# Altium schematic sheet Sheet1.SchDoc
size A
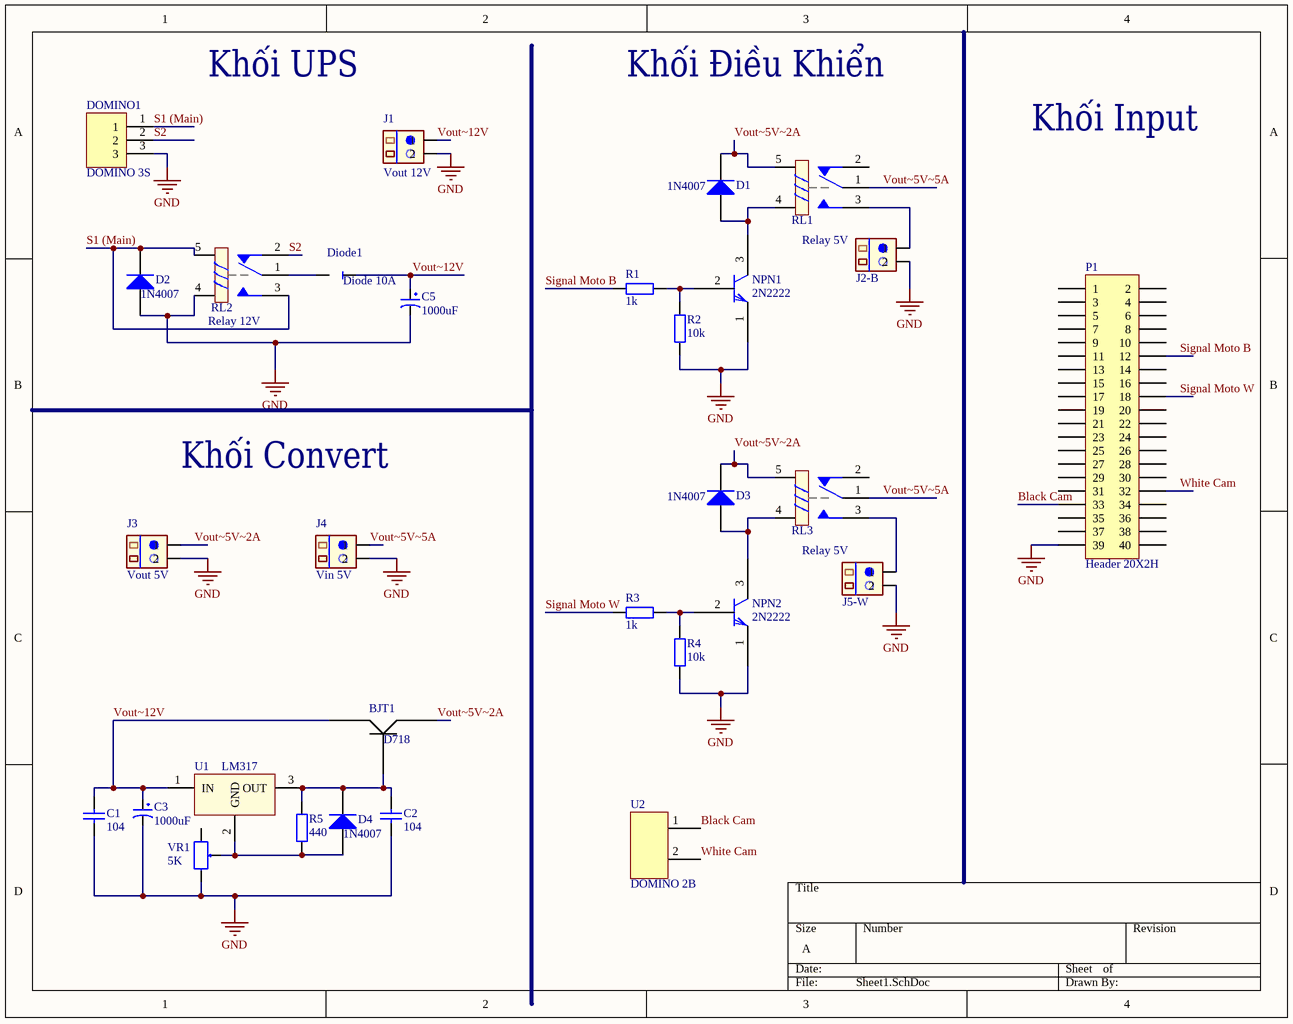
[diagram p0: Sheet1.SchDoc]

## Parts
BJT1  D718  [2sb688]
C1  104  [tu gom]
C2  104  [tu gom]
C3  1000uF  [tu hoa 13mm]
C5  1000uF  [tu hoa 13mm]
D1  1N4007  [DO-41]
D2  1N4007  [DO-41]
D3  1N4007  [DO-41]
D4  1N4007  [DO-41]
Diode1  Diode 10A  [Diode 6A10]
DOMINO1  DOMINO 3S  [DOMINO 3S]
J1  Vout 12V  [Domino 2M]
J2-B  CON.Domino2  [Domino 2M]  (value not drawn)
J3  Vout 5V  [Domino 2M]
J4  Vin 5V  [Domino 2M]
J5-W  CON.Domino2  [Domino 2M]  (value not drawn)
NPN1  2N2222  [PCBComponent_1]
NPN2  2N2222  [PCBComponent_1]
P1  Header 20X2H  [HDR2X20H]
R1  1k  [tro vach 1/4w]
R2  10k  [tro vach 1/4w]
R3  1k  [tro vach 1/4w]
R4  10k  [tro vach 1/4w]
R5  440  [tro vach 1/4w]
RL1  Relay 5V  [PCBComponent_1 - duplicate]
RL2  Relay 12V  [RELAY5PIN-10A]
RL3  Relay 5V  [PCBComponent_1 - duplicate]
U1  LM317  [QTO-220H3]
U2  DOMINO 2B  [DOMINO 2B]
VR1  5K  [RVAR10K]

## Nets
GND: C1.2 C2.2 C3.2 C5.2 D2.1(A) DOMINO1.3 J1.2 J2-B.2 J3.2 J4.2 J5-W.2 NPN1.1 NPN2.1 P1.39 R2.1 R4.1 RL2.4 VR1.3
Black Cam: P1.33 U2.1
S1 (Main): D2.2(K) DOMINO1.1 RL2.3 RL2.5
S2: DOMINO1.2 RL2.2
Signal Moto B: P1.12 R1.1
Signal Moto W: P1.18 R3.1
Vout~5V~2A: BJT1.3 D1.2(K) D3.2(K) J3.1 RL1.5 RL3.5
Vout~5V~5A: J4.1 RL1.1 RL3.1
Vout~12V: BJT1.2 C1.1 C3.1 C5.1 Diode1.2 J1.1 U1.1(IN)
White Cam: P1.32 U2.2
NetBJT1_1: BJT1.1 C2.1 D4.2(K) R5.2 U1.3(OUT)
NetD1_1: D1.1(A) NPN1.3 RL1.4
NetD3_1: D3.1(A) NPN2.3 RL3.4
NetD4_1: D4.1(A) R5.1 U1.2(GND) VR1.2
NetDiode1_1: Diode1.1 RL2.1
NetJ2-B_1: J2-B.1 RL1.3
NetJ5-W_1: J5-W.1 RL3.3
NetNPN1_2: NPN1.2 R1.2 R2.2
NetNPN2_2: NPN2.2 R3.2 R4.2

Not connected (* = marked no-connect by the designer): P1 1 2 3 4 5 6 7 8 9 10 11 13 14 15 16 17 19 20 21 22 23 24 25 26 27 28 29 30 31 34 35 36 37 38 40; RL1 2; RL3 2; VR1 1

## Notes on the sheet
- Khối UPS
- Khối Điều Khiển
- Khối Input
- Khối Convert

## Library data of the parts
BJT1 = BJT 2sb688
C1 C2 = Tu gom 104 50V: Cắm; So_Chan: 2; Ten_Linh_Kien: Tụ gốm 104 100nF 50V; Don_Vi: Con; Ma_Hang: MH004761; Chung_Loai: Cắm; Kieu_Chan: *
C3 C5 = Tu Hoa 1000uF 25V 13x21: Cắm; Don_Vi: Con; So_Chan: 2; Ten_Linh_Kien: Tụ Hóa 1000uF 25V 13x21MM; Ma_Hang: MH002315; Chung_Loai: Cắm; Kieu_Chan: *
D1-D4 = Diode 1N4007: 1 Amp General Purpose Rectifier; Published: 8-Jun-2000; LatestRevisionDate: 17-Jul-2002; LatestRevisionNote: Re-released for DXP Platform.; DatasheetVersion: 1998; PackageVersion: Aug-1999; PackageReference: DO-41; Publisher: Altium Limited; PackageDescription: Diode, Axial; Body 5.2 x 2.7 mm (LxDia. max), Lead Dia. 0.86 mm (max); Code_JEDEC: DO-204-AL; ComponentLink1Description: Manufacturer Link; ComponentLink1URL: http://www.fairchildsemi.com/; ComponentLink2Description: Datasheet; ComponentLink2URL: http://www.fairchildsemi.com/ds/1N%2F1N4001.pdf
Diode1 = Diode 6A10
J1 J2-B J5-W = CON.Domino2: 2 pins Domino Header; Publisher: Hoang Nguyen; ComponentLink1Description: Digikey Part link; ComponentLink2Description: Open DataSheet; ComponentLink2URL: H:\LIBRARY\LIBRARY.Datasheet\; Price: 2000VND
J3 = CON.Domino2: Source DC 5V for Servo; Publisher: Hoang Nguyen; ComponentLink1Description: Digikey Part link; ComponentLink2Description: Open DataSheet; ComponentLink2URL: H:\LIBRARY\LIBRARY.Datasheet\; Price: 2000VND
J4 = CON.Domino2: Source DC from MODULE; Publisher: Hoang Nguyen; ComponentLink1Description: Digikey Part link; ComponentLink2Description: Open DataSheet; ComponentLink2URL: H:\LIBRARY\LIBRARY.Datasheet\; Price: 2000VND
NPN1 NPN2 = Component_1
P1 = Header 20X2H: Header, 20-Pin, Dual row, Right Angle; LatestRevisionDate: 17-Jul-2002; LatestRevisionNote: Re-released for DXP Platform.; Publisher: Altium Limited
R1 R3 R5 = Tro Vach 1/4W 5% 1k: Cắm; Don_Vi: Con; So_Chan: 2; Ten_Linh_Kien: Trở Vạch 1/4w 5% 1k; Ma_Hang: MH007390; Chung_Loai: Cắm; Kieu_Chan: *
R2 R4 = Tro Vach 1/4W 1% 10k: Cắm; Don_Vi: Con; So_Chan: 2; Ten_Linh_Kien: Trở Vạch 1/4w 1% 10k; Ma_Hang: MH006349; Chung_Loai: Cắm; Kieu_Chan: *
RL1-RL3 = Relay 10A: Cắm; Value: Relay ?V - 10A
U1 = 78xx: LM78xx, on ap +
VR1 = Bien Tro Tinh Chinh 1K: Cắm; Don_Vi: Con; Ten_Linh_Kien: Biến Trở VR 102-1K 3296W; Ma_Hang: MH003234; Kieu_Chan: *; Chung_Loai: Cắm